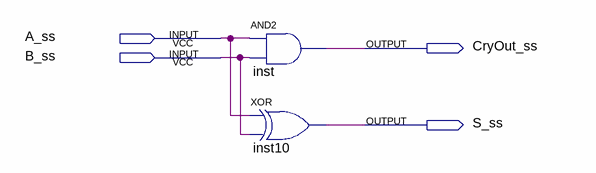
[diagram p0: schematic sheet]
// Quartus schematic SemiSumador.bdf as structural Verilog: 2 symbols, 4 pins
module SemiSumador (
  input  A_ss,
  input  B_ss,
  output CryOut_ss,
  output S_ss
);

  and inst (CryOut_ss, A_ss, B_ss);
  xor inst10 (S_ss, A_ss, B_ss);
endmodule
